# EAGLE design phase v3 (EAGLE 9.1.2)
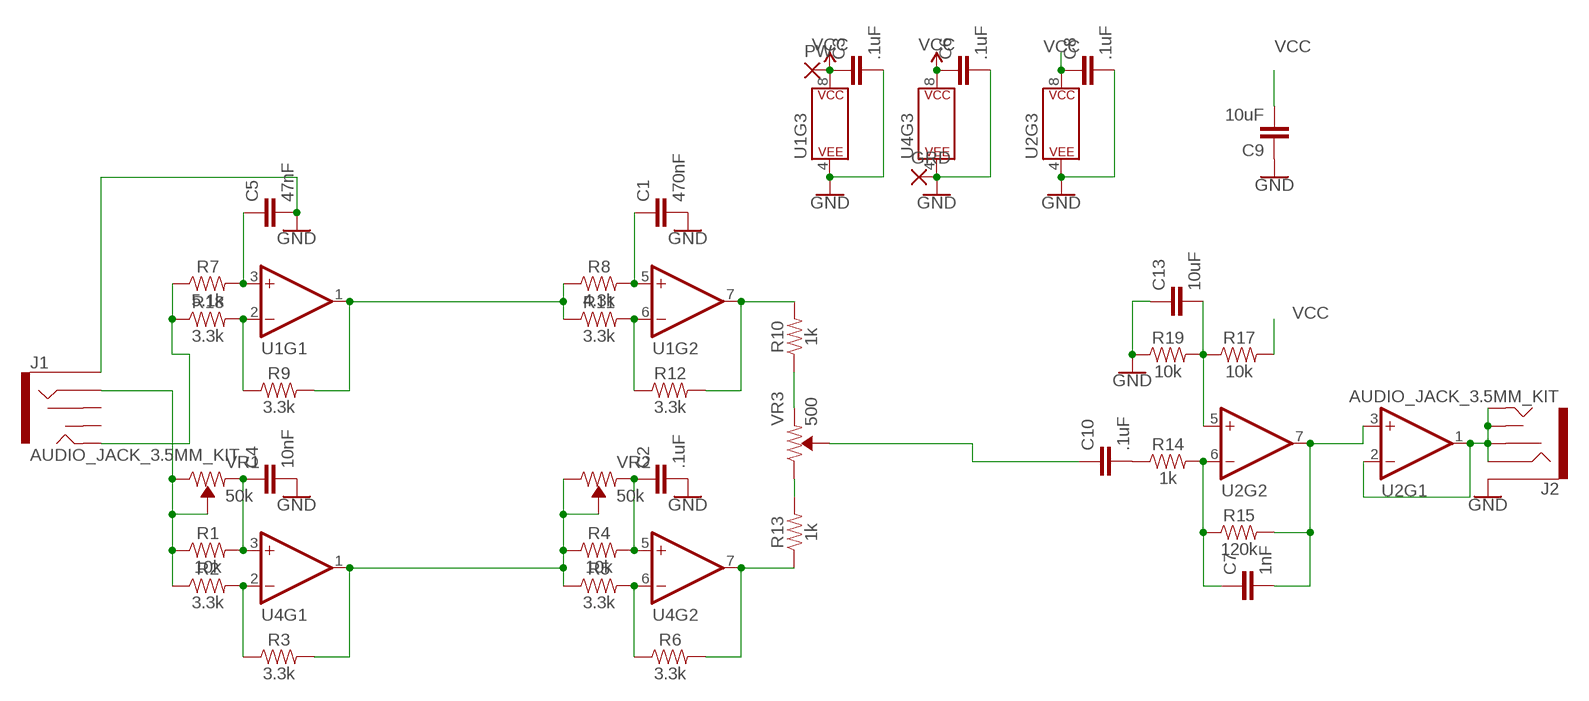
[diagram p0: schematic, sheet 1]

## Parts
C1  470nF  1.0UF-0805-25V-(+80/-20%)  [0805]
C2  .1uF  1.0UF-0805-25V-(+80/-20%)  [0805]
C3  .1uF  1.0UF-0805-25V-(+80/-20%)  [0805]
C4  10nF  1.0UF-0805-25V-(+80/-20%)  [0805]
C5  47nF  1.0UF-0805-25V-(+80/-20%)  [0805]
C6  .1uF  1.0UF-0805-25V-(+80/-20%)  [0805]
C7  1nF  1.0UF-0805-25V-(+80/-20%)  [0805]
C8  .1uF  1.0UF-0805-25V-(+80/-20%)  [0805]
C9  10uF  C5/3.5  [C5B3.5]
C10  .1uF  1.0UF-0805-25V-(+80/-20%)  [0805]
C13  10uF  C5/3.5  [C5B3.5]
GRD  2,54/1,1  [2,54/1,1]
J1  AUDIO_JACK_3.5MM_KIT  [AUDIO-JACK-KIT]
J2  AUDIO_JACK_3.5MM_KIT  [AUDIO-JACK-KIT]
PW  2,54/1,1  [2,54/1,1]
R1  10k  0.3OHM-0805-1/8W-1%  [0805]
R2  3.3k  0.3OHM-0805-1/8W-1%  [0805]
R3  3.3k  0.3OHM-0805-1/8W-1%  [0805]
R4  10k  0.3OHM-0805-1/8W-1%  [0805]
R5  3.3k  0.3OHM-0805-1/8W-1%  [0805]
R6  3.3k  0.3OHM-0805-1/8W-1%  [0805]
R7  5.1k  0.3OHM-0805-1/8W-1%  [0805]
R8  4.3k  0.3OHM-0805-1/8W-1%  [0805]
R9  3.3k  0.3OHM-0805-1/8W-1%  [0805]
R10  1k  0.3OHM-0805-1/8W-1%  [0805]
R11  3.3k  0.3OHM-0805-1/8W-1%  [0805]
R12  3.3k  0.3OHM-0805-1/8W-1%  [0805]
R13  1k  0.3OHM-0805-1/8W-1%  [0805]
R14  1k  0.3OHM-0805-1/8W-1%  [0805]
R15  120k  0.3OHM-0805-1/8W-1%  [0805]
R17  10k  0.3OHM-0805-1/8W-1%  [0805]
R18  3.3k  0.3OHM-0805-1/8W-1%  [0805]
R19  10k  0.3OHM-0805-1/8W-1%  [0805]
U1  LM358DIP08-SOIC  [SO08]
U2  LM358DIP08-SOIC  [SO08]
U4  LM358DIP08-SOIC  [SO08]
VR1  50k  TRIMPOT-PTH-10MM-KNOB-1/2W-10%  [TRIMPOT-PTH-3386U]
VR2  50k  TRIMPOT-PTH-10MM-KNOB-1/2W-10%  [TRIMPOT-PTH-3386U]
VR3  500  TRIMPOT-PTH-10MM-KNOB-1/2W-10%  [TRIMPOT-PTH-3386U]

## Nets
GND: C1.2 C2.2 C3.2 C4.2 C5.2 C6.2 C8.2 C9.1 C13.1 GRD.1(P) J1.SLEEVE J2.SLEEVE R19.1 U1.4(P$V-) U2.4(P$V-) U4.4(P$V-)
N$1: C4.1 R1.2 U4.3(+IN) VR1.1(CCW)
N$2: R2.2 R3.1 U4.2(-IN)
N$3: R3.2 R4.1 R5.1 U4.1(OUT) VR2.2(WIPER) VR2.3(CW)
N$4: J1.RING R1.1 R2.1 VR1.2(WIPER) VR1.3(CW)
N$5: C2.1 R4.2 U4.5(+IN) VR2.1(CCW)
N$6: R5.2 R6.1 U4.6(-IN)
N$7: R9.1 R18.2 U1.2(-IN)
N$8: R6.2 R13.1 U4.7(OUT)
N$9: C5.1 R7.2 U1.3(+IN)
N$10: J1.TIP R7.1 R18.1
N$11: C1.1 R8.2 U1.5(+IN)
N$12: R8.1 R9.2 R11.1 U1.1(OUT)
N$13: R11.2 R12.1 U1.6(-IN)
N$14: R10.1 VR3.1(CCW)
N$15: R10.2 R12.2 U1.7(OUT)
N$16: R13.2 VR3.3(CW)
N$17: C10.2 R14.1
N$18: C10.1 VR3.2(WIPER)
N$19: C7.2 R15.2 U2.3(+IN) U2.7(OUT)
N$20: C13.2 R17.1 R19.2 U2.5(+IN)
N$21: C7.1 R14.2 R15.1 U2.6(-IN)
N$22: J2.RING J2.RSH J2.TIP J2.TSH U2.1(OUT) U2.2(-IN)
VCC: C3.1 C6.1 C8.1 C9.2 PW.1(P) R17.2 U1.8(P$V+) U2.8(P$V+) U4.8(P$V+)
Unconnected: J1.RSH J1.TSH

## Library data of the parts
C1-C8 C10 = SparkFun-Capacitors:1.0UF: 1µF ceramic capacitors A capacitor is a passive two-terminal electrical component used to store electrical energy temporarily in an electric field.; PROD_ID: CAP-11625; VALUE: 1.0uF
C9 C13 = capacitor-wima:C: CAPACITOR naming: grid - package width
GRD PW = wirepad:2,54/1,1: THROUGH-HOLE PAD
J1 J2 = SparkFun-Connectors:AUDIO_JACK_3.5MM: Audio Jack 3.5mm variants of PTH and SMT stereo audio jack with bypass switches. SparkFun Products: SparkFun SparkPunk Sound Kit <[https://www.sparkfun.com/products/11177]> - PTH MP3 Trigger <https://www.sparkfun.com/products/13720> -3.5mm SMD SparkFun PicoBoard <https://www.sparkfun.com/products/11888>- 2.5mm SMD; PROD_ID: CONN-08774; SF_ID: PRT-08032
R1-R15 R17-R19 = SparkFun-Resistors:0.3OHM: 0.3Ω resistor A resistor is a passive two-terminal electrical component that implements electrical resistance as a circuit element. Resistors act to reduce current flow, and, at the same time, act to lower voltage levels within circuits. - Wikipedia; PROD_ID: RES-11622; VALUE: 0.3
U1 U2 U4 = SparkFun-IC-Amplifiers:LM358: LM358 Jellybean op-amp Datasheet <http://www.sparkfun.com/datasheets/Components/General/LM358.pdf> SparkFun Products Op-Amp (Thru-Hole) - LM358 <https://www.sparkfun.com/products/9456> (COM-09456)
VR1-VR3 = SparkFun-Resistors:TRIMPOT: Trimming Potentiometer (Trimpot) Three-terminal potentiometers, with an adjustable wiper and two adjustable resistors. A pot can be used to create a configurable voltage divider, or as a variable resistor. "Trimpots" are a subset of potentiometers, usually intended for "set-and-forget" applications. They're often more delicate than standard potentiometers - rated for fewer turns. Variants PTH-KNOB - PTH Trimpot w/ finger-adjustable knob Trimpot 10K with Knob <https://www.sparkfun.com/products/9806> (COM-09806) Datasheet <http://www.sparkfun.com/datasheets/Components/General/TSR-3386.pdf> SMD-3MM-CLOSED-FRAME - SMD 3mm Square Closed-Frame Trimpot Used on e.g. EasyDriver - Stepper Motor Driver <https://www.sparkfun.com/products/12779> Datasheet <http://www.bitechnologies.com/pdfs/22.pdf> (22AR10KTR) SMD-5MM - SMD 5mm Square Closed-Frame Trimpot Used on e.g. IOIO-OTG - V2.2 <https://www.sparkfun.com/products/13613> Datasheet <http://www.vishay.com/docs/51008/ts53.pdf> (TS53YL502MR10) SMD-3MM-1/10W-25% - 3mm Square Open-Frame Trimpot Used on e.g. SparkFun Shapeoko <https://www.sparkfun.com/products/13899> Datasheet <http://www.bourns.com/docs/Product-Datasheets/TC33.pdf> (TC33X-2-103E); PROD_ID: RES-09730; SF_SKU: COM-09806; VALUE: 10k

## Net classes
0 default: width 0.762 mm, drill 0.762 mm, clearance 0.508 mm

## Board
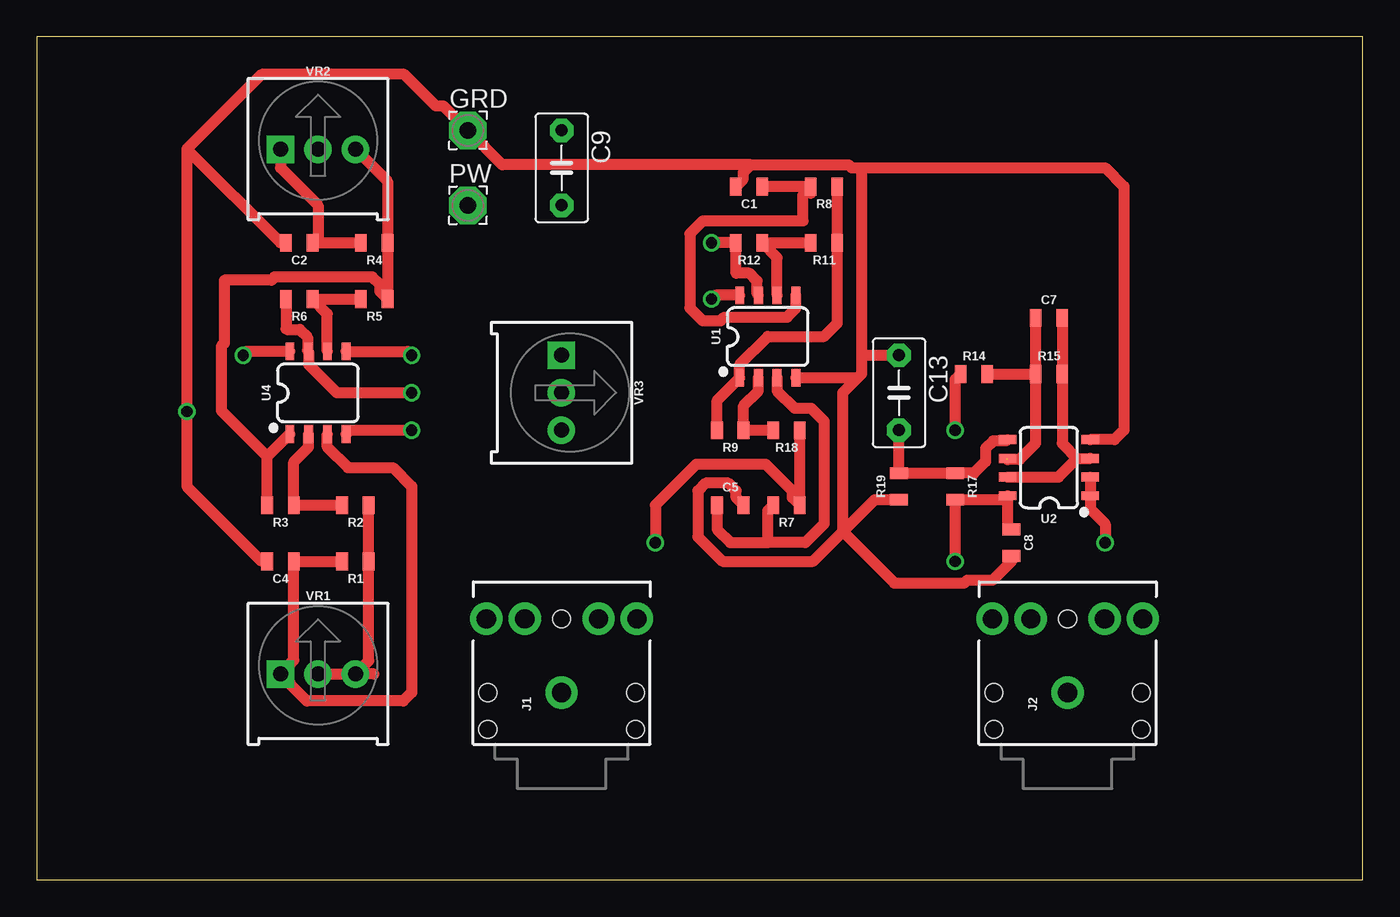
[diagram p1: board, top side]
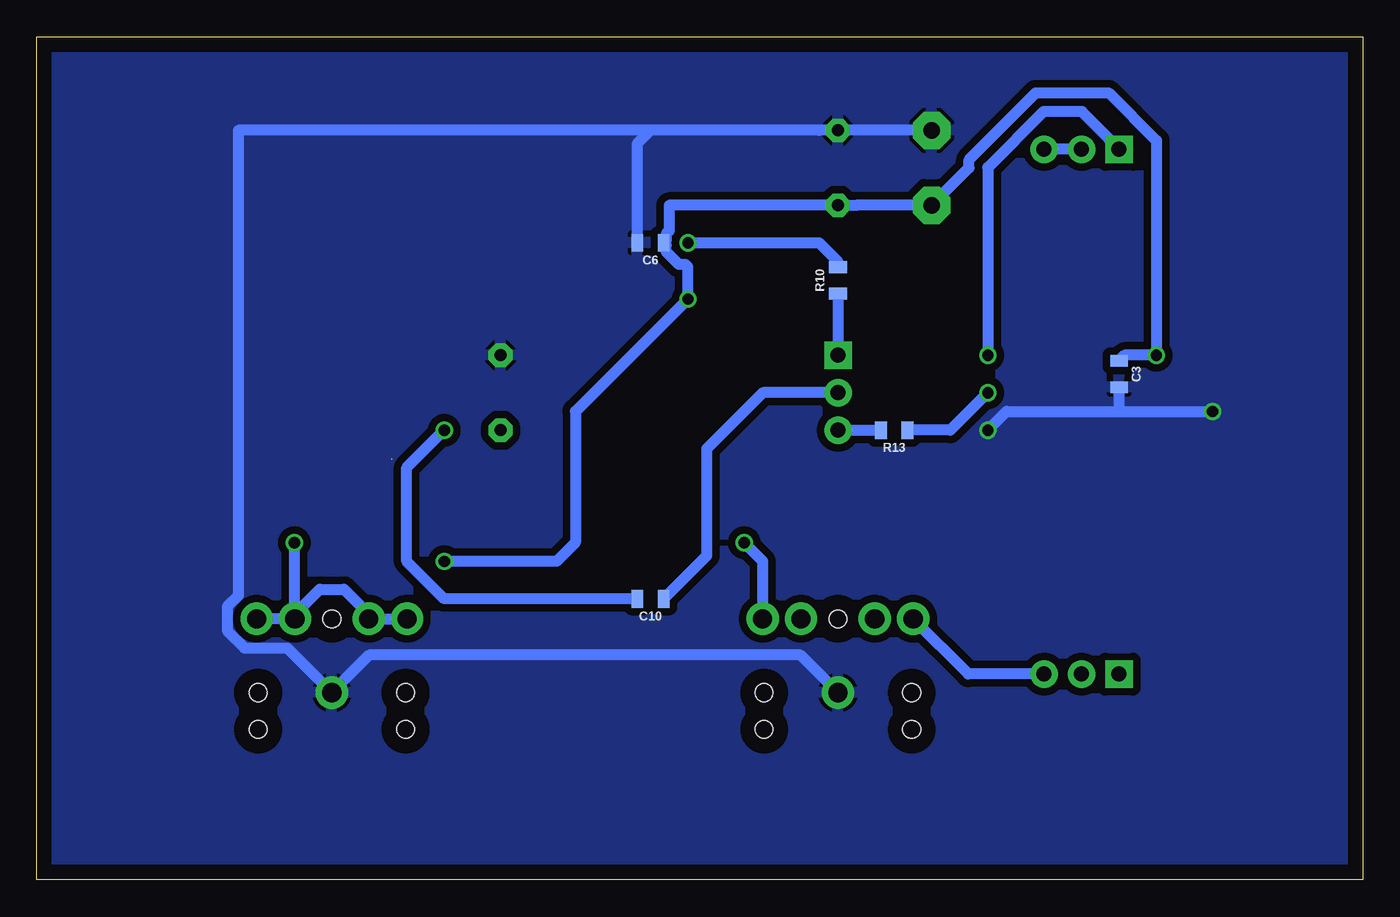
[diagram p2: board, bottom side, seen from below]

Size 89.84 x 57.14 mm. Coordinates in mm from the lower left corner, seen from the top.
Outline: 0,0 89.84,0 89.84,57.14 0,57.14 0,0
Copper layers (1*16): Top 0.035mm / dielectric 1.5mm / Bottom 0.035mm
Design rules "default": minimum track width 6mil, minimum drill 0.35mm, track to track 6mil, track to pad 6mil, pad to pad 6mil, via to via 6mil, smd to smd 6mil, copper to edge 40mil, drill to drill 6mil, minimum pad ring 10mil, minimum via ring 8mil, stop-mask expansion 4mil, vias tented up to drill 0mil, thermal gap 10mil

### Footprints (pad centres in the part's own frame; a part is rotated, then mirrored left to right if it is on the bottom)
0805 = smd 0.8 x 1.2: 1 -0.9,0; 2 0.9,0
C5B3.5 = drill 0.813 pad 1.6 octagon: 1 -2.54,0; 2 2.54,0
2,54/1,1 = drill 1.118 pad 2.54 octagon: 1 0,0
AUDIO-JACK-KIT = drill 1.3 pad 2.184: RING 5,5.1; RSH 5,2.5; SLEEVE 0,0; TIP 5,-5.1; TSH 5,-2.5 | hole 1.2: 0,5; -2.5,5; -2.5,-5; 0,-5; 5,0
SO08 = smd 0.6 x 1.2: 1 -1.905,-2.8; 2 -0.635,-2.8; 3 0.635,-2.8; 4 1.905,-2.8; 5 1.905,2.8; 6 0.635,2.8; 7 -0.635,2.8; 8 -1.905,2.8
TRIMPOT-PTH-3386U = drill 1.016 pad 1.88 square: 1 -2.54,-0.015 | drill 1.016 pad 1.88: 2 0,-0.015; 3 2.54,-0.015

### Placement (x,y rotation side)
C1  48.26,46.99 180 top
C2  17.78,43.18 180 top
C3  16.51,34.29 270 bottom
C4  16.51,21.59 180 top
C5  46.99,25.4 0 top
C6  48.26,43.18 180 bottom
C7  68.58,38.1 0 top
C8  66.04,22.86 270 top
C9  35.56,48.26 270 top
C10  48.26,19.05 180 bottom
C13  58.42,33.02 270 top
GRD  29.21,50.8 0 top
J1  35.56,12.7 90 top
J2  69.85,12.7 90 top
PW  29.21,45.72 0 top
R1  21.59,21.59 180 top
R2  21.59,25.4 180 top
R3  16.51,25.4 180 top
R4  22.86,43.18 180 top
R5  22.86,39.37 180 top
R6  17.78,39.37 180 top
R7  50.8,25.4 180 top
R8  53.34,46.99 180 top
R9  46.99,30.48 180 top
R10  35.56,40.64 90 bottom
R11  53.34,43.18 180 top
R12  48.26,43.18 180 top
R13  31.75,30.48 180 bottom
R14  63.5,34.29 0 top
R15  68.58,34.29 0 top
R17  62.23,26.67 270 top
R18  50.8,30.48 180 top
R19  58.42,26.67 90 top
U1  49.53,36.83 0 top
U2  68.58,27.94 90 top
U4  19.05,33.02 0 top
VR1  19.05,13.97 0 top
VR2  19.05,49.53 0 top
VR3  35.56,33.02 270 top

### Tracks (layer width: path | path; a pad name or v marks a point on that pad's centre or on a via)
GND  (via drill 0.76)
  Top 0.762: C5.2 47.38,25.91 47.38,26.37 46.86,26.89 45.32,26.89 44.8,26.37 44.8,23.25 46.46,21.59 52.6,21.59 54.61,23.6 | 55.62,34.03 55.88,34.29 55.88,35.56 | 55.62,34.03 U1.4 | 55.62,34.03 54.61,33.02 54.61,23.6 | C1.2 47.87,47.5 47.87,47.96 48.39,48.48 | 48.39,48.48 55.01,48.48 55.23,48.26 55.88,48.26 | 55.88,48.26 55.88,35.56 | 48.39,48.48 31.53,48.48 GRD.1 27.56,52.45 27.05,52.45 24.89,54.61 15.24,54.61 10.16,49.53 | 10.16,49.53 v10.16,31.75 10.16,26.67 15.24,21.59 C4.2 | U4.4 21.21,30.48 v25.4,30.48 | 10.16,49.53 16.51,43.18 C2.2 | 55.88,48.26 72.39,48.26 73.66,46.99 73.66,30.48 73.03,29.85 U2.4 | 54.61,23.6 58.1,20.12 62.84,20.12 63.04,20.32 64.77,20.32 66.04,21.59 C8.2 | 54.61,23.6 56.78,25.77 R19.1 | 55.88,35.56 C13.1
  Bottom 0.762: v25.4,30.48 24.13,31.75 16.51,31.75 | 16.51,31.75 v10.16,31.75 | C3.2 16.51,31.75 | 48.26,50.8 49.16,49.9 C6.2 | GRD.1 C9.1 36.83,50.8 48.26,50.8 | 48.26,50.8 76.2,50.8 76.2,19.25 76.93,18.52 76.93,16.88 75.77,15.72 72.87,15.72 J2.SLEEVE 67.31,15.24 38.1,15.24 J1.SLEEVE
  pour Bottom: 0,58.42 88.9,58.42 88.9,1.27 0,1.27
N$1
  Top 0.762: R1.2 C4.1 17.41,14.9 17.22,14.71 17.22,14.67 VR1.1 17.22,13.24 17.22,13.2 18.29,12.13 24.83,12.13 25.4,12.7 25.4,26.67 24.13,27.94 21.08,27.94 19.68,29.33 U4.3
N$2
  Top 0.762: U4.2 18.41,29.33 17.41,28.33 R3.1 R2.2
N$3
  Top 0.762: R3.2 15.61,28.68 | 15.61,28.68 U4.1 | VR2.3 23.76,47.34 R4.1 R5.1 23.25,39.88 23.25,40.34 22.73,40.86 16.11,40.86 15.89,40.64 12.7,40.64 12.7,36.37 12.5,36.17 12.5,31.8 15.61,28.68
  Bottom 0.762: VR2.2 VR2.3
N$4
  Top 0.762: 22.84,13.96 VR1.3 | VR1.3 22.49,14.86 R1.1 R2.1 | VR1.2 VR1.3
  Bottom 0.762: VR1.3 26.71,13.96 J1.RING
N$5  (via drill 0.76)
  Top 0.762: VR2.1 16.51,48.26 19.05,45.72 19.05,43.55 C2.1 R4.2 | U4.5 25.14,35.82 v25.4,35.56
  Bottom 0.762: VR2.1 17.22,50.23 17.22,50.27 19.02,52.07 21.62,52.07 25.4,48.29 v25.4,35.56
N$6
  Top 0.762: U4.6 19.68,38.36 R6.1 R5.2
N$7
  Top 0.762: U1.2 48.9,33.14 47.89,32.14 R9.1 R18.2
N$8  (via drill 0.76)
  Top 0.762: R6.2 16.88,37.36 16.93,37.31 17.81,37.31 18.33,36.79 18.33,35.9 U4.7 18.41,34.93 20.33,33.02 v25.4,33.02
  Bottom 0.762: v25.4,33.02 27.94,30.48 R13.1
N$9
  Top 0.762: C5.1 46.09,23.76 46.99,22.86 49.53,22.86 | 49.53,22.86 49.53,25.03 R7.2 | U1.3 50.16,33.14 51.34,31.97 52.47,31.97 53.34,31.1 53.34,24.13 52.07,22.86 49.53,22.86
N$10  (via drill 0.76)
  Top 0.762: R18.1 R7.1 51.19,25.91 51.19,26.37 49.4,28.16 44.67,28.16 41.91,25.4 v41.91,22.86
  Bottom 0.762: v41.91,22.86 40.66,21.61 J1.TIP
N$11
  Top 0.762: R8.2 C1.1 | R8.2 52.44,46.53 | U1.5 51.44,38.74 50.83,38.14 46.57,38.14 46.33,37.9 45.11,37.9 44.25,38.76 44.25,43.79 45.13,44.67 51.92,44.67 51.92,46.47 R8.2
N$12
  Top 0.762: R9.2 46.09,32.5 U1.1 47.62,34.92 49.54,36.83 53.34,36.83 54.24,37.73 R11.1 R8.1
N$13
  Top 0.762: U1.6 50.16,42.17 R12.1 R11.2
N$14
  Bottom 0.762: R10.1 VR3.1
N$15  (via drill 0.76)
  Top 0.762: U1.7 48.81,39.71 48.81,40.6 48.29,41.12 47.41,41.12 47.36,41.17 R12.2 v45.72,43.18
  Bottom 0.762: v45.72,43.18 36.83,43.18 35.56,41.91 R10.2
N$16
  Bottom 0.762: VR3.3 R13.2
N$17  (via drill 0.76)
  Top 0.762: R14.1 62.23,33.92 v62.23,30.48
  Bottom 0.762: C10.2 62.23,19.05 64.77,21.59 64.77,27.94 v62.23,30.48
N$18
  Bottom 0.762: VR3.2 40.64,33.02 44.45,29.21 44.45,21.96 C10.1
N$19
  Top 0.762: 70.49,28.57 69.48,29.59 R15.2 C7.2 | 70.49,28.57 U2.3 | U2.7 69.22,27.31 70.49,28.57
N$20
  Top 0.762: U2.5 65.7,29.76 64.81,29.76 64.29,29.24 64.29,28.36 63.51,27.57 R17.1 R19.2 C13.2
N$21  (1 unrouted)
  Top 0.762: R15.1 67.68,29.58 66.59,28.49 65.78,28.49 | R14.2 R15.1 | C7.1 R15.1
N$22  (via drill 0.76)
  Top 0.762: U2.2 U2.1 71.38,25.14 72.39,24.13 v72.39,22.86
  Bottom 0.762: v72.39,22.86 72.39,17.74 | 72.39,17.74 J2.TSH 71.85,18.2 71.85,18.53 70.68,19.7 69.02,19.7 67.85,18.53 67.85,18.32 67.31,17.78 67.31,17.74 J2.RSH J2.RING | J2.TIP 74.91,17.74 72.39,17.74
VCC  (via drill 0.76)
  Top 0.762: U1.8 45.98,39.63 v45.72,39.37 | U4.8 14.23,35.82 v13.97,35.56 | v62.23,21.59 R17.2 65.52,25.77 U2.8 65.78,24.02 C8.1
  Bottom 0.762: C3.1 16.14,35.56 v13.97,35.56 13.97,50.11 17.2,53.34 22.15,53.34 26.67,48.82 26.67,48.26 PW.1 34.29,45.72 C9.2 46.99,45.72 46.99,43.99 47.19,43.79 47.19,43.35 C6.1 47.19,43.01 47.19,42.57 46.33,41.71 45.89,41.71 45.72,41.54 v45.72,39.37 53.34,31.75 53.34,22.86 54.61,21.59 v62.23,21.59